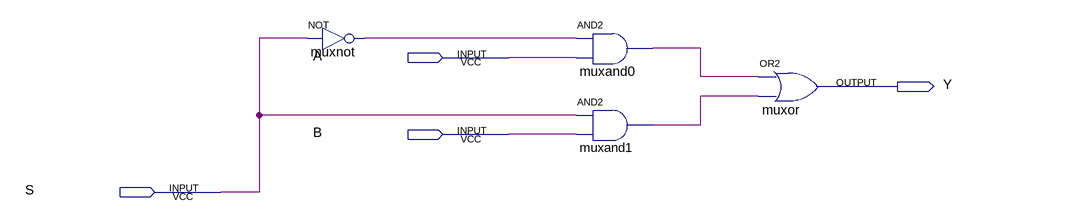
[diagram p0: schematic sheet]
// Quartus schematic ryu_21mux.bdf as structural Verilog: 4 symbols, 4 pins
module ryu_21mux (
  input  A,
  input  B,
  input  S,
  output Y
);

  wire muxand0_out, muxand1_out, muxnot_out;

  not muxnot (muxnot_out, S);
  and muxand0 (muxand0_out, muxnot_out, A);
  and muxand1 (muxand1_out, S, B);
  or muxor (Y, muxand0_out, muxand1_out);
endmodule
